# EAGLE design arm-pro-tiny (EAGLE 6.5.0)
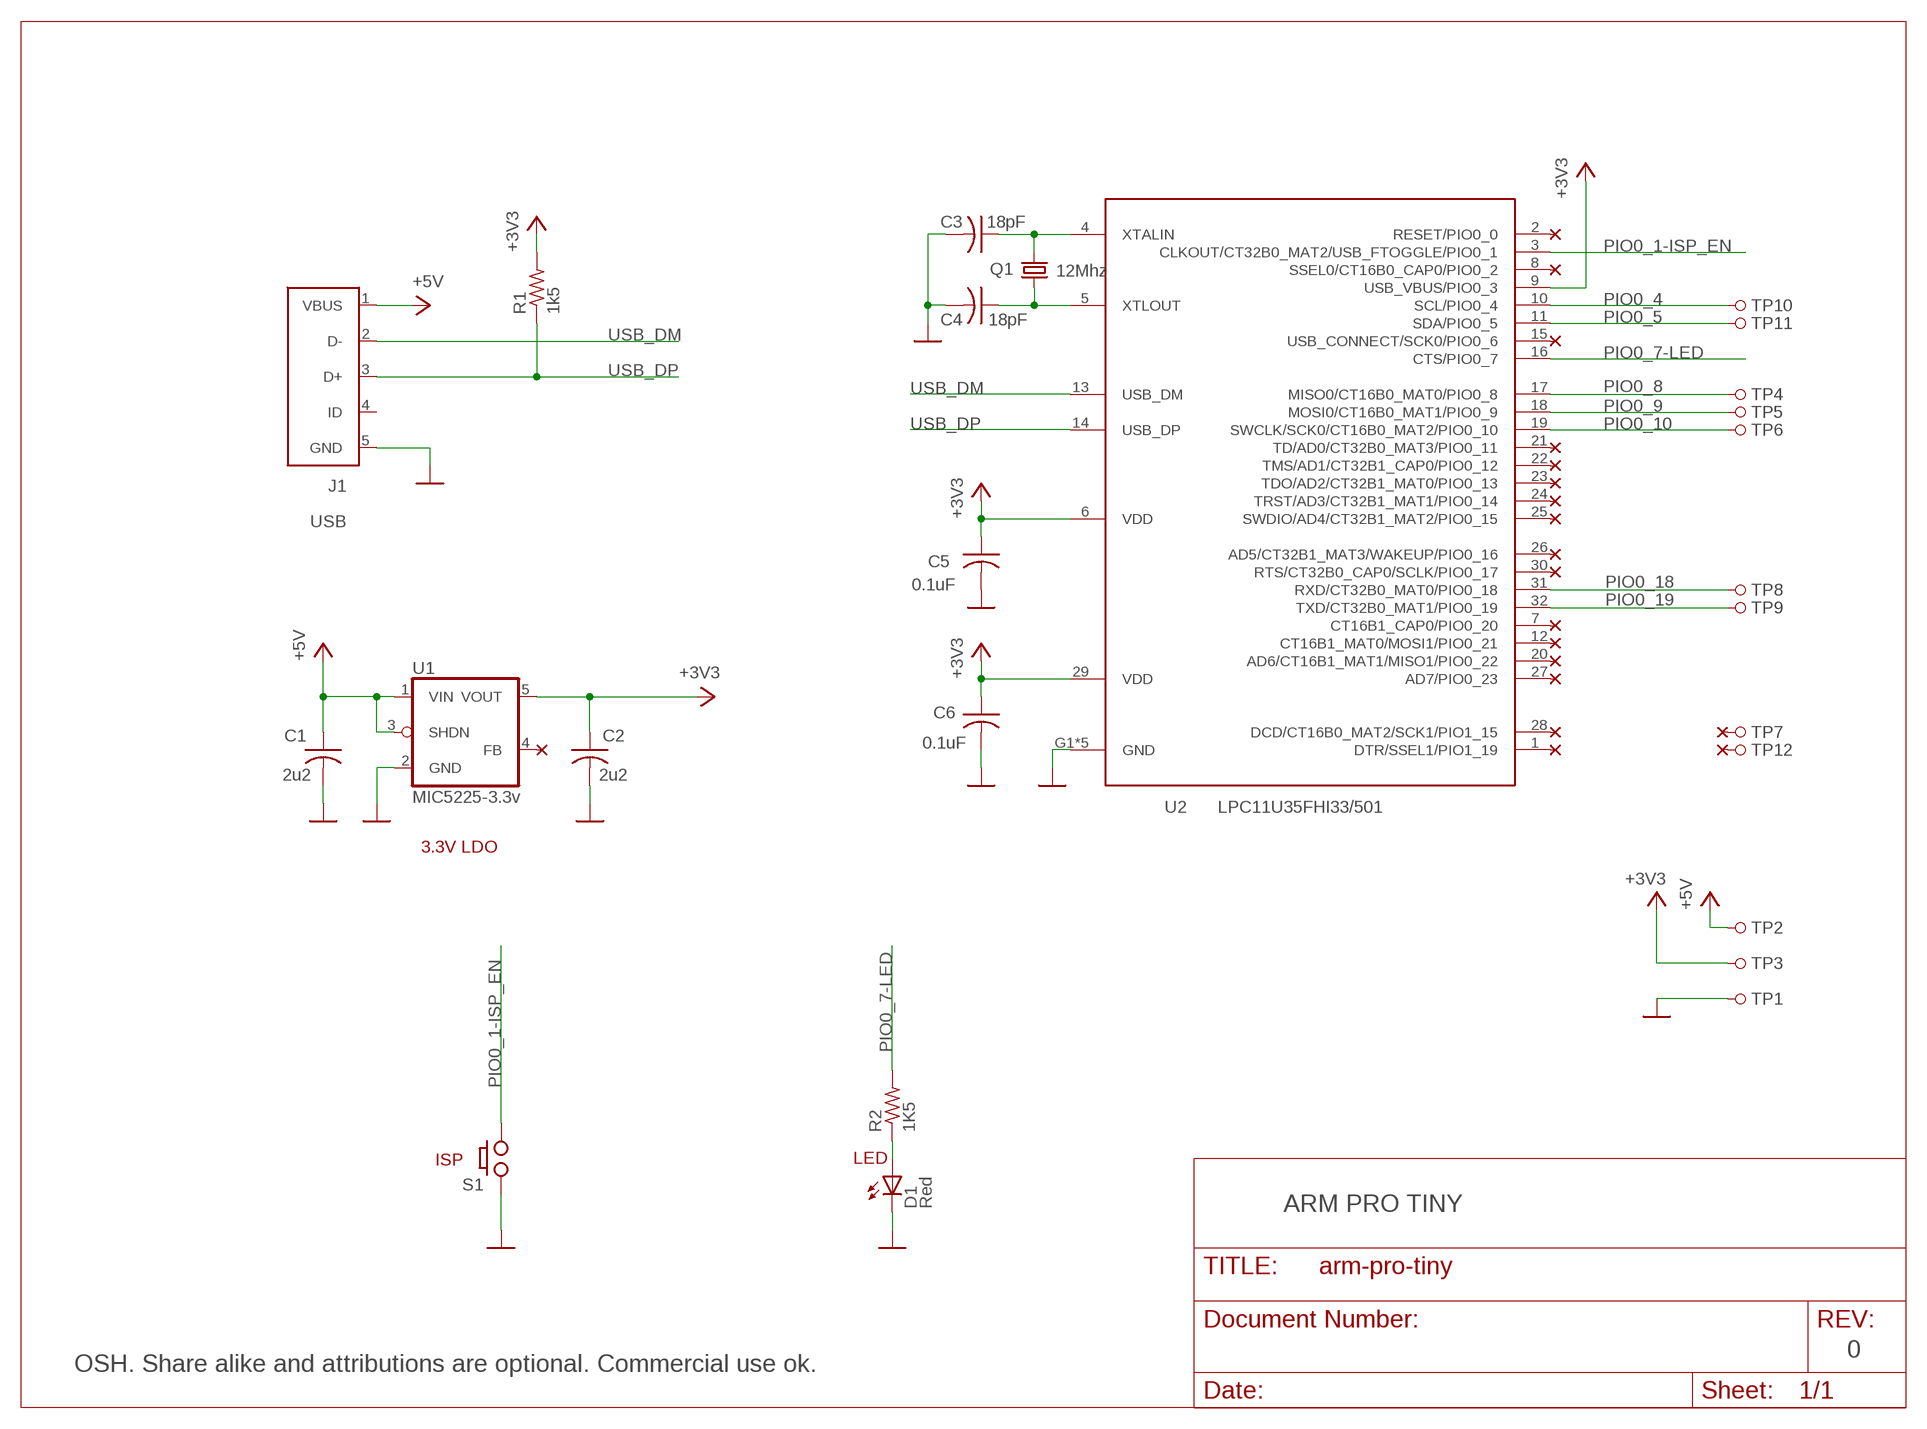
[diagram p0: schematic, sheet 1]

## Parts
C1  2u2  C-USC0402K  [C0402K]
C2  2u2  C-USC0402K  [C0402K]
C3  18pF  C-USC0402K  [C0402K]
C4  18pF  C-USC0402K  [C0402K]
C5  0.1uF  C-USC0402K  [C0402K]
C6  0.1uF  C-USC0402K  [C0402K]
D1  Red  LEDCHIP-LED0603  [CHIP-LED0603]
J1  USB  [USB-MICRO-ZX62RD-AB-5P8]
Q1  12Mhz  CRYSTALCTS406  [CRYSTAL]
R1  1k5  R-US_R0402  [R0402]
R2  1K5  R-US_R0402  [R0402]
S1  PUSH_BUTTON  [PUSH_BUTTON]
TP1  HDR1  PINHD-1X1  [1X01]
TP2  HDR1  PINHD-1X1  [1X01]
TP3  HDR1  PINHD-1X1  [1X01]
TP4  HDR1  PINHD-1X1  [1X01]
TP5  HDR1  PINHD-1X1  [1X01]
TP6  HDR1  PINHD-1X1  [1X01]
TP7  HDR1  PINHD-1X1  [1X01]
TP8  HDR1  PINHD-1X1  [1X01]
TP9  HDR1  PINHD-1X1  [1X01]
TP10  HDR1  PINHD-1X1  [1X01]
TP11  HDR1  PINHD-1X1  [1X01]
TP12  HDR1  PINHD-1X1  [1X01]
U1  MIC5225-3.3v  TC1015  [SOT25]
U2  LPC11U35FHI33/501  LPC11U35FHN33/501  [HVQFN33-5MM]

## Nets
+3V3: C2.1 C5.1 C6.1 R1.2 TP3.1 U1.5(VOUT) U2.6(VDD) U2.9(USB_VBUS/PIO0_3) U2.29(VDD)
+5V: C1.1 J1.1(VBUS) TP2.1 U1.1(VIN) U1.3(SHDN)
GND: C1.2 C2.2 C3.2 C4.2 C5.2 C6.2 D1.C J1.5(GND) S1.A1 TP1.1 U1.2(GND) U2.G1(GND) U2.G2(GND) U2.G3(GND) U2.G4(GND) U2.TAB(GND)
N$1: C3.1 Q1.3 U2.4(XTALIN)
N$3: C4.1 Q1.1 U2.5(XTLOUT)
N$6: D1.A R2.1
PIO0_1-ISP_EN: S1.B2 U2.3(CLKOUT/CT32B0_MAT2/USB_FTOGGLE/PIO0_1)
PIO0_4: TP10.1 U2.10(SCL/PIO0_4)
PIO0_5: TP11.1 U2.11(SDA/PIO0_5)
PIO0_7-LED: R2.2 U2.16(CTS/PIO0_7)
PIO0_8: TP4.1 U2.17(MISO0/CT16B0_MAT0/PIO0_8)
PIO0_9: TP5.1 U2.18(MOSI0/CT16B0_MAT1/PIO0_9)
PIO0_10: TP6.1 U2.19(SWCLK/SCK0/CT16B0_MAT2/PIO0_10)
PIO0_18: TP8.1 U2.31(RXD/CT32B0_MAT0/PIO0_18)
PIO0_19: TP9.1 U2.32(TXD/CT32B0_MAT1/PIO0_19)
USB_DM [critical]: J1.2(D-) U2.13(USB_DM)
USB_DP [critical]: J1.3(D+) R1.1 U2.14(USB_DP)
Unconnected: J1.4(ID) TP7.1 TP12.1 U1.4(FB) U2.1(DTR/SSEL1/PIO1_19) U2.2(RESET/PIO0_0) U2.7(CT16B1_CAP0/PIO0_20) U2.8(SSEL0/CT16B0_CAP0/PIO0_2) U2.12(CT16B1_MAT0/MOSI1/PIO0_21) U2.15(USB_CONNECT/SCK0/PIO0_6) U2.20(AD6/CT16B1_MAT1/MISO1/PIO0_22) U2.21(TD/AD0/CT32B0_MAT3/PIO0_11) U2.22(TMS/AD1/CT32B1_CAP0/PIO0_12) U2.23(TDO/AD2/CT32B1_MAT0/PIO0_13) U2.24(TRST/AD3/CT32B1_MAT1/PIO0_14) U2.25(SWDIO/AD4/CT32B1_MAT2/PIO0_15) U2.26(AD5/CT32B1_MAT3/WAKEUP/PIO0_16) U2.27(AD7/PIO0_23) U2.28(DCD/CT16B0_MAT2/SCK1/PIO1_15) U2.30(RTS/CT32B0_CAP0/SCLK/PIO0_17)

## Notes on the sheet
- 3.3V LDO
- ISP | LED
- ARM PRO TINY
- 0
- OSH. Share alike and attributions are optional. Commercial use ok.

## Library data of the parts
C1-C6 = arm-pro-tiny:C-US: CAPACITOR, American symbol
D1 = arm-pro-tiny:LED: LED OSRAM: - CHIPLED LG R971, LG N971, LY N971, LG Q971, LY Q971, LO R971, LY R971 LH N974, LH R974 LS Q976, LO Q976, LY Q976 LO Q996 - Hyper CHIPLED LW Q18S LB Q993, LB Q99A, LB R99A - SideLED LS A670, LO A670, LY A670, LG A670, LP A670 LB A673, LV A673, LT A673, LW A673 LH A674 LY A675 LS A676, LA A676, LO A676, LY A676, LW A676 LS A679, LY A679, LG A679 - Hyper Micro SIDELED® LS Y876, LA Y876, LO Y876, LY Y876 LT Y87S - SmartLED LW L88C, LW L88S LB L89C, LB L89S, LG L890 LS L89K, LO L89K, LY L89K LS L896, LA L896, LO L896, LY L896 - TOPLED LS T670, LO T670, LY T670, LG T670, LP T670 LSG T670, LSP T670, LSY T670, LOP T670, LYG T670 LG T671, LOG T671, LSG T671 LB T673, LV T673, LT T673, LW T673 LH T674 LS T676, LA T676, LO T676, LY T676, LB T676, LH T676, LSB T676, LW T676 LB T67C, LV T67C, LT T67C, LS T67K, LO T67K, LY T67K, LW E67C LS E67B, LA E67B, LO E67B, LY E67B, LB E67C, LV E67C, LT E67C LW T67C LS T679, LY T679, LG T679 LS T770, LO T770, LY T770, LG T770, LP T770 LB T773, LV T773, LT T773, LW T773 LH T774 LS E675, LA E675, LY E675, LS T675 LS T776, LA T776, LO T776, LY T776, LB T776 LHGB T686 LT T68C, LB T68C - Hyper Mini TOPLED® LB M676 - Mini TOPLED Santana® LG M470 LS M47K, LO M47K, LY M47K Source: http://www.osram.convergy.de LUXEON: - LUMILED® LXK2-PW12-R00, LXK2-PW12-S00, LXK2-PW14-U00, LXK2-PW14-V00 LXK2-PM12-R00, LXK2-PM12-S00, LXK2-PM14-U00 LXK2-PE12-Q00, LXK2-PE12-R00, LXK2-PE12-S00, LXK2-PE14-T00, LXK2-PE14-U00 LXK2-PB12-K00, LXK2-PB12-L00, LXK2-PB12-M00, LXK2-PB14-N00, LXK2-PB14-P00, LXK2-PB14-Q00 LXK2-PR12-L00, LXK2-PR12-M00, LXK2-PR14-Q00, LXK2-PR14-R00 LXK2-PD12-Q00, LXK2-PD12-R00, LXK2-PD12-S00 LXK2-PH12-R00, LXK2-PH12-S00 LXK2-PL12-P00, LXK2-PL12-Q00, LXK2-PL12-R00 Source: www.luxeon.com KINGBRIGHT: KA-3528ASYC Source: www.kingbright.com
J1 = arm-pro-tiny:USB
Q1 = arm-pro-tiny:CRYSTAL: CRYSTAL; OC_FARNELL: unknown; OC_NEWARK: unknown
R1 R2 = arm-pro-tiny:R-US_: RESISTOR, American symbol
S1 = arm-pro-tiny:PUSH_BUTTON: CKN10502CT-ND
TP1-TP12 = arm-pro-tiny:PINHD-1X1: PIN HEADER
U1 = arm-pro-tiny:TC1015: 150mA Low Noise LDO Voltage Regulator with Enable TSC [Taiwan Semiconductor Company, Ltd] Source: http://www.taiwansemi.com .. 5205_0409c.pdf
U2 = arm-pro-tiny:LPC11U35FHN33/501

## Net classes
1 power: width 0.254 mm

## Board
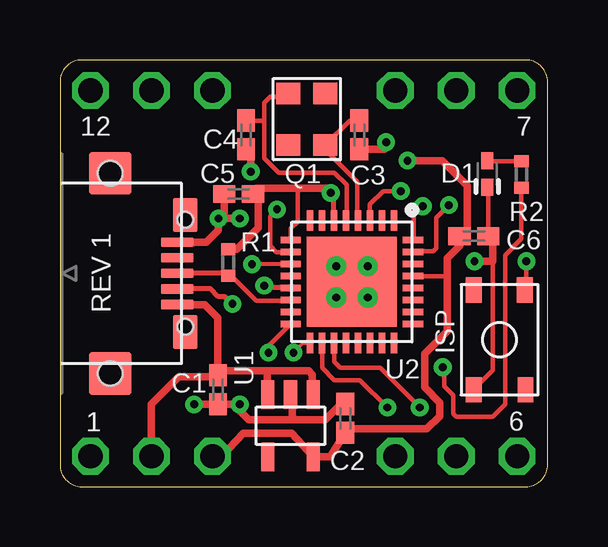
[diagram p1: board, top side]
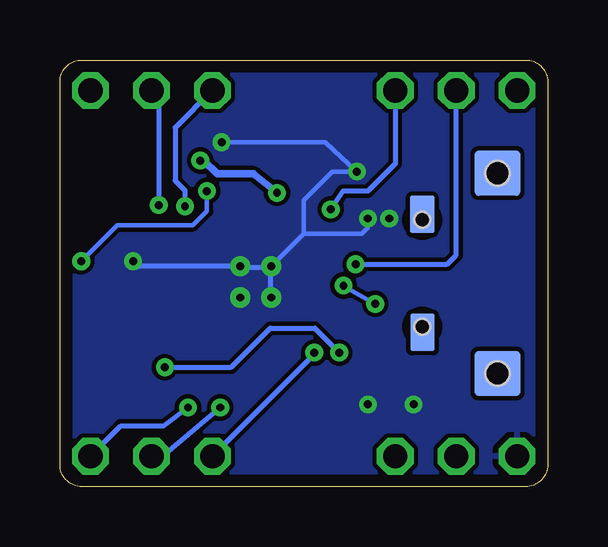
[diagram p2: board, bottom side, seen from below]

Size 20.32 x 17.78 mm. Coordinates in mm from the lower left corner, seen from the top.
Outline: 0,16.86 0,0.92 arc90 0.92,0 19.4,0 arc90 20.32,0.92 20.32,16.86 arc90 19.4,17.78 0.92,17.78 arc90 0,16.86
Copper layers (1*16): Top 0.035mm / dielectric 1.5mm / Bottom 0.035mm
Design rules "default *": minimum track width 6mil, minimum drill 13mil, track to track 7mil, track to pad 7mil, pad to pad 7mil, via to via 7mil, smd to smd 0mil, copper to edge 20mil, drill to drill 8mil, minimum pad ring 10mil, minimum via ring 8mil, stop-mask expansion 4mil, vias tented up to drill 20mil, thermal gap 10mil

### Footprints (pad centres in the part's own frame; a part is rotated, then mirrored left to right if it is on the bottom)
C0402K = smd 0.925 x 0.74: 1 -0.6,0; 2 0.6,0
CHIP-LED0603 = smd 0.5 x 0.7: A 0,-0.55; C 0,0.55
USB-MICRO-ZX62RD-AB-5P8 = smd 0.4 x 1.35: 1 1.3,5.425; 2 0.65,5.425; 3 0,5.425; 4 -0.65,5.425; 5 -1.3,5.425 | smd 1.778 x 1.778: A1 -4.175,2.625; B1 4.175,2.625 | smd 1.88 x 1.88 bottom: A2 -4.175,2.625; B2 4.175,2.625 | smd 1.422 x 1.016: C1 -2.431,5.757; D1 2.435,5.749 | smd 1.575 x 1.016 bottom: C2 -2.457,5.757; D2 2.461,5.749 | hole 0.65: -2.225,5.75; 2.225,5.75 | hole 1.016: 4.175,2.625; -4.175,2.625
CRYSTAL = smd 0.9 x 1: 1 -1.075,-0.775; 2 1.075,-0.775; 3 1.075,0.775; 4 -1.075,0.775
R0402 = smd 0.5 x 0.6: 1 -0.55,0; 2 0.55,0
PUSH_BUTTON = smd 1.05 x 0.65: A1 -2.075,1.075; A2 2.075,1.075; B1 -2.075,-1.075; B2 2.075,-1.05
1X01 = drill 1.016 octagon: 1 0,0
SOT25 = smd 0.55 x 1.2: 1 -0.95,-1.3; 2 0,-1.3; 3 0.95,-1.3; 4 0.95,1.3; 5 -0.95,1.3
HVQFN33-5MM = smd 0.85 x 0.27: 1 -2.55,1.75; 2 -2.55,1.25; 3 -2.55,0.75; 4 -2.55,0.25; 5 -2.55,-0.25; 6 -2.55,-0.75; 7 -2.55,-1.25; 8 -2.55,-1.75; 17 2.55,-1.75; 18 2.55,-1.25; 19 2.55,-0.75; 20 2.55,-0.25; 21 2.55,0.25; 22 2.55,0.75; 23 2.55,1.25; 24 2.55,1.75 | smd 0.27 x 0.85: 9 -1.75,-2.55; 10 -1.25,-2.55; 11 -0.75,-2.55; 12 -0.25,-2.55; 13 0.25,-2.55; 14 0.75,-2.55; 15 1.25,-2.55; 16 1.75,-2.55; 25 1.75,2.55; 26 1.25,2.55; 27 0.75,2.55; 28 0.25,2.55; 29 -0.25,2.55; 30 -0.75,2.55; 31 -1.25,2.55; 32 -1.75,2.55 | drill 0.33 pad 0.6: G1 -0.65,0.65; G2 -0.65,-0.65; G3 0.65,-0.65; G4 0.65,0.65 | smd 3.75 x 3.75: TAB 0,0

### Placement (x,y rotation side)
C1  6.58,4.04 270 top
C2  11.89,2.84 90 top
C3  12.47,14.66 270 top
C4  7.75,14.66 270 top
C5  7.44,12.19 180 top
C6  17.25,10.44 0 top
D1  17.81,13.03 180 top
J1  -0.53,8.89 270 top
Q1  10.29,15.32 270 top
R1  7.01,9.35 90 top
R2  19.23,13 270 top
S1  18.31,6.12 90 top
TP1  1.27,1.27 0 top
TP2  3.81,1.27 0 top
TP3  6.35,1.27 0 top
TP4  13.97,1.27 0 top
TP5  16.51,1.27 0 top
TP6  19.05,1.27 0 top
TP7  19.05,16.51 0 top
TP8  16.51,16.51 0 top
TP9  13.97,16.51 0 top
TP10  6.35,16.51 0 top
TP11  3.81,16.51 0 top
TP12  1.27,16.51 0 top
U1  9.6,2.54 180 top
U2  12.17,8.53 270 top

### Tracks (layer width: path | path; a pad name or v marks a point on that pad's centre or on a via)
+3V3  (via drill 0.33)
  Top 0.152: 16.96,10.36 17.02,10.41 C6.1
  Top 0.178: 17.02,10.29 16.96,10.36 16.89,10.43 | 12.05,2.41 C2.1 12.06,2.41 | 16.92,10.44 C6.1 | 16.89,10.68 C6.1 | 9.65,10.32 U2.9 9.62,10.76 9.91,11.05 9.91,12.45 | 8.17,12.45 C5.1 8.26,11.98 | 16.97,10.76 C6.1 | U2.29 14.74,8.76 16.13,8.76
  Top 0.203: U2.6 11.4,11.08 11.4,12.12 v11.28,12.24
  Top 0.305: C2.1 11.26,1.24 U1.5 9.66,2.23 7.64,2.23 6.73,1.27 TP3.1 | 8.17,12.45 9.91,12.45 11.07,12.45 v11.28,12.24 | 8.26,11.98 8.26,10.79 7.36,9.9 R1.2 | v14.48,13.59 15.93,13.59 16.97,12.55 16.97,10.76 | C6.1 16.65,10.04 16.13,9.53 16.13,8.76 16.13,6.48 15.19,5.54 15.19,4.14 15.82,3.5 15.82,2.95 15.29,2.41 12.06,2.41
  Bottom 0.178: 14.33,13.59 v14.48,13.59
  Bottom 0.305: v11.28,12.24 12.27,13.03 13.77,13.03 14.33,13.59
+5V
  Top 0.178: 8.64,3.94 U1.3 | 10.54,3.94 U1.1 | 6.77,4.83 C1.1 6.51,4.57
  Top 0.305: 8.64,4.83 8.64,3.94 | 8.64,4.83 6.77,4.83 | 6.51,4.57 4.95,4.57 3.81,3.43 TP2.1 | 8.64,4.83 10.36,4.83 10.52,4.67 10.52,3.88 U1.1 | J1.1 6.02,7.59 6.58,7.04 C1.1
GND  (via drill 0.33)
  Top 0.152: U2.G3 U2.TAB U2.G4 | 9.68,3.73 U1.2 | 17.25,4.06 S1.A1
  Top 0.178: 12.06,3.17 C2.2 11.7,3.44 | 9.65,3.81 U1.2 | 12.32,13.97 C3.2 | 17.25,4.06 18.03,4.85 18.03,9.4 | 18.03,10.25 C6.2 17.85,12.44 D1.C | v7.49,3.43 v7.48,3.44 7.47,3.43 | 5.46,3.43 5.47,3.44 C1.2 | C4.2 7.95,13.85
  Top 0.305: 9.68,2.79 11.05,2.79 11.7,3.44 | 9.68,2.79 9.68,3.73 | v13.59,14.35 13.5,14.06 C3.2 | 18.03,10.25 18.03,9.4 v17.27,9.4 | C5.2 6.84,11.41 v6.6,11.18 | 9.68,2.79 7.87,2.79 7.49,3.17 v7.49,3.43 | 7.47,3.43 5.46,3.43 | v6.6,11.18 7.62,11.18 | 7.95,13.85 v7.95,13.13 | v6.6,11.18 6.6,10.69 6.1,10.19 J1.5
  Bottom 0.178: 10.16,10.54 U2.G2 11.56,9.14 | 11.56,8 U2.G3 | 12.7,9.14 U2.G1 | 10.16,10.54 7.75,10.54 7.49,10.79 v7.49,11.18 | 10.16,10.54 10.16,11.94 8.97,13.13 v7.95,13.13 9.27,14.35 v13.59,14.35
  Bottom 0.203: U2.G1 17.06,9.18 v17.27,9.4 | 11.56,8 11.56,9.14 12.7,9.14
  other vias: 5.59,3.43
  pour Bottom: 0,0 20.32,0 20.32,17.78 0,17.78
N$1
  Top 0.178: C3.1 12.08,15.26 Q1.3 | 11.3,14 Q1.3 | U2.4 12.45,11.11 12.39,11.16 12.39,12.7 11.06,14.03 Q1.3 | 11.35,13.95 Q1.3
N$3
  Top 0.178: 7.75,14.99 C4.1 8.51,15.26 | U2.5 11.94,11.18 11.94,12.57 11.43,13.08 9.12,13.08 8.51,13.69 8.51,13.84 8.51,14.35 8.51,15.26 | 8.51,15.26 8.51,16 8.76,16.26 9.38,16.26 Q1.1
N$6
  Top 0.178: D1.A 17.83,13.55 R2.1
PIO0_1-ISP_EN  (via drill 0.33)
  Top 0.152: 19.41,8.23 19.38,8.2 S1.B2 | 12.93,11.1 U2.3
  Top 0.178: S1.B2 19.42,8.26 19.43,8.26 19.3,8.38 19.43,8.51 v19.43,9.4 | 12.93,11.1 12.95,11.12 | v14.2,12.32 13.46,12.32 12.92,11.77 U2.3
  Bottom 0.178: v19.43,9.4 17.93,10.9 14.78,10.9 14.2,11.48 v14.2,12.32
PIO0_4  (via drill 0.33)
  Top 0.152: 9.6,9.8 U2.10
  Top 0.178: U2.10 9.53,9.78 9.02,9.78 8.76,10.03 8.76,11.28 v9.04,11.56
  Bottom 0.203: TP10.1 6.35,13.46 7.49,12.32 8.53,12.32 v9.04,11.56
PIO0_5  (via drill 0.33)
  Top 0.152: 9.6,9.3 U2.11
  Top 0.178: 9.6,9.3 v8,9.27
  Bottom 0.203: v8,9.27 4.19,9.27 3.81,9.65 TP11.1
PIO0_7-LED  (via drill 0.33)
  Top 0.152: 9.6,6.78 U2.16
  Top 0.178: U2.16 8.69,5.86 v8.69,5.59 | v15.95,4.98 16,4.95 16,4.19 16.38,3.81 16.38,3.05 16.51,2.92 18.03,2.92 18.54,3.43 18.54,9.65 19.23,10.34 R2.2
  Bottom 0.203: v15.95,4.98 13.18,4.98 11.56,6.6 9.7,6.6 v8.69,5.59
PIO0_8  (via drill 0.33)
  Top 0.152: v9.73,5.59 10.11,5.97 U2.17
  Bottom 0.203: v9.73,5.59 9.73,5.51 TP4.1
PIO0_9  (via drill 0.33)
  Top 0.152: U2.18
  Top 0.178: U2.18 10.92,5.54 10.92,4.95 11.43,4.45 12.5,4.45 v13.64,3.3
  Bottom 0.203: TP5.1 16.05,1.27 v13.64,3.3
PIO0_10  (via drill 0.33)
  Top 0.152: U2.19
  Top 0.178: U2.19 11.42,5.54 11.43,5.54 11.43,5.21 11.68,4.95 13.34,4.95 v14.99,3.3
  Bottom 0.203: TP6.1 17.78,2.54 16,2.54 v14.99,3.3
PIO0_18  (via drill 0.33)
  Top 0.152: 14.73,9.8 U2.31
  Top 0.178: 14.73,9.8 15.54,9.8 15.67,9.93 15.67,11.2 v16.2,11.73
  Bottom 0.203: v16.2,11.73 16.2,16.2 TP8.1
PIO0_19  (via drill 0.33)
  Top 0.152: 14.73,10.29 U2.32
  Top 0.178: 14.73,10.29 14.73,11.3 v15.11,11.68
  Bottom 0.203: TP9.1 15.52,14.96 15.52,12.75 15.11,12.34 v15.11,11.68
USB_DM  (via drill 0.33)
  Top 0.178: U2.13 9.6,8.31 | 7.16,7.62 v7.19,7.62
  Top 0.203: 9.6,8.31 9.57,8.28 8.61,8.28 v8.51,8.38 | 7.16,7.62 6.86,7.92 6.6,7.92 6.29,8.24 J1.2
  Bottom 0.203: v8.51,8.38 v7.19,7.62
USB_DP
  Top 0.178: U2.14 9.58,7.75 9.55,7.77 9.53,7.75 8.18,7.75 7.13,8.8 R1.1 6.93,8.72
  Top 0.203: 6.93,8.72 6.76,8.89 J1.3

### Text on the board
tNames: 12 | 7 | REV 1 | ISP | 1 | 6
Document: TP12 | TP11 | TP10 | TP9 | TP8 | TP7 | TP1 | TP2 | TP3 | TP4 | TP5 | TP6 | OSH. Share alike and attributions / are optional. Commercial use ok.